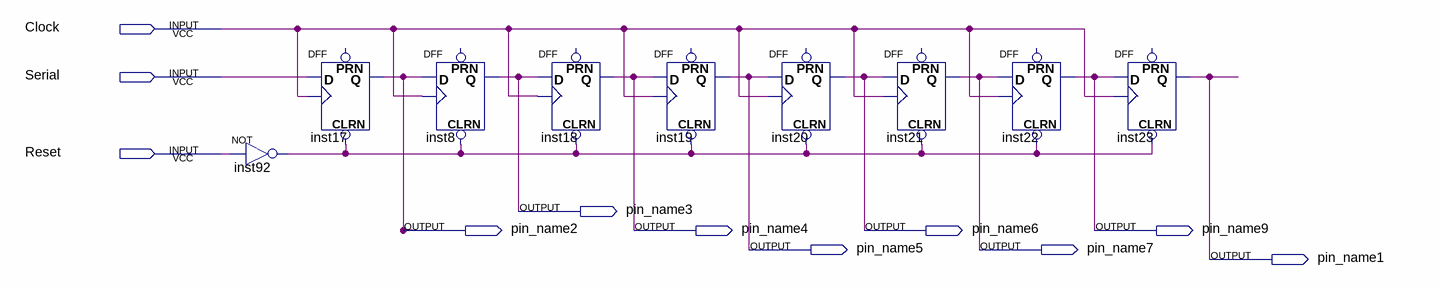
[diagram p0: schematic sheet]
// Quartus schematic ShiftRegister.bdf as structural Verilog: 9 symbols, 11 pins
module ShiftRegister (
  input  Clock,
  input  Serial,
  input  Reset,
  output pin_name3,
  output pin_name2,
  output pin_name4,
  output pin_name6,
  output pin_name9,
  output pin_name5,
  output pin_name7,
  output pin_name1
);

  wire inst92_out;

  not inst92 (inst92_out, Reset);
  DFF inst17 (.CLRN(inst92_out), .CLK(Clock), .D(Serial), .Q(pin_name2));  // open: PRN
  DFF inst8 (.CLRN(inst92_out), .CLK(Clock), .D(pin_name2), .Q(pin_name3));  // open: PRN
  DFF inst18 (.CLRN(inst92_out), .CLK(Clock), .D(pin_name3), .Q(pin_name4));  // open: PRN
  DFF inst19 (.CLRN(inst92_out), .CLK(Clock), .D(pin_name4), .Q(pin_name5));  // open: PRN
  DFF inst20 (.CLRN(inst92_out), .CLK(Clock), .D(pin_name5), .Q(pin_name6));  // open: PRN
  DFF inst21 (.CLRN(inst92_out), .CLK(Clock), .D(pin_name6), .Q(pin_name7));  // open: PRN
  DFF inst22 (.CLRN(inst92_out), .CLK(Clock), .D(pin_name7), .Q(pin_name9));  // open: PRN
  DFF inst23 (.CLRN(inst92_out), .CLK(Clock), .D(pin_name9), .Q(pin_name1));  // open: PRN
endmodule
